# EAGLE schematic 604_romwriter (EAGLE 7.4.0)
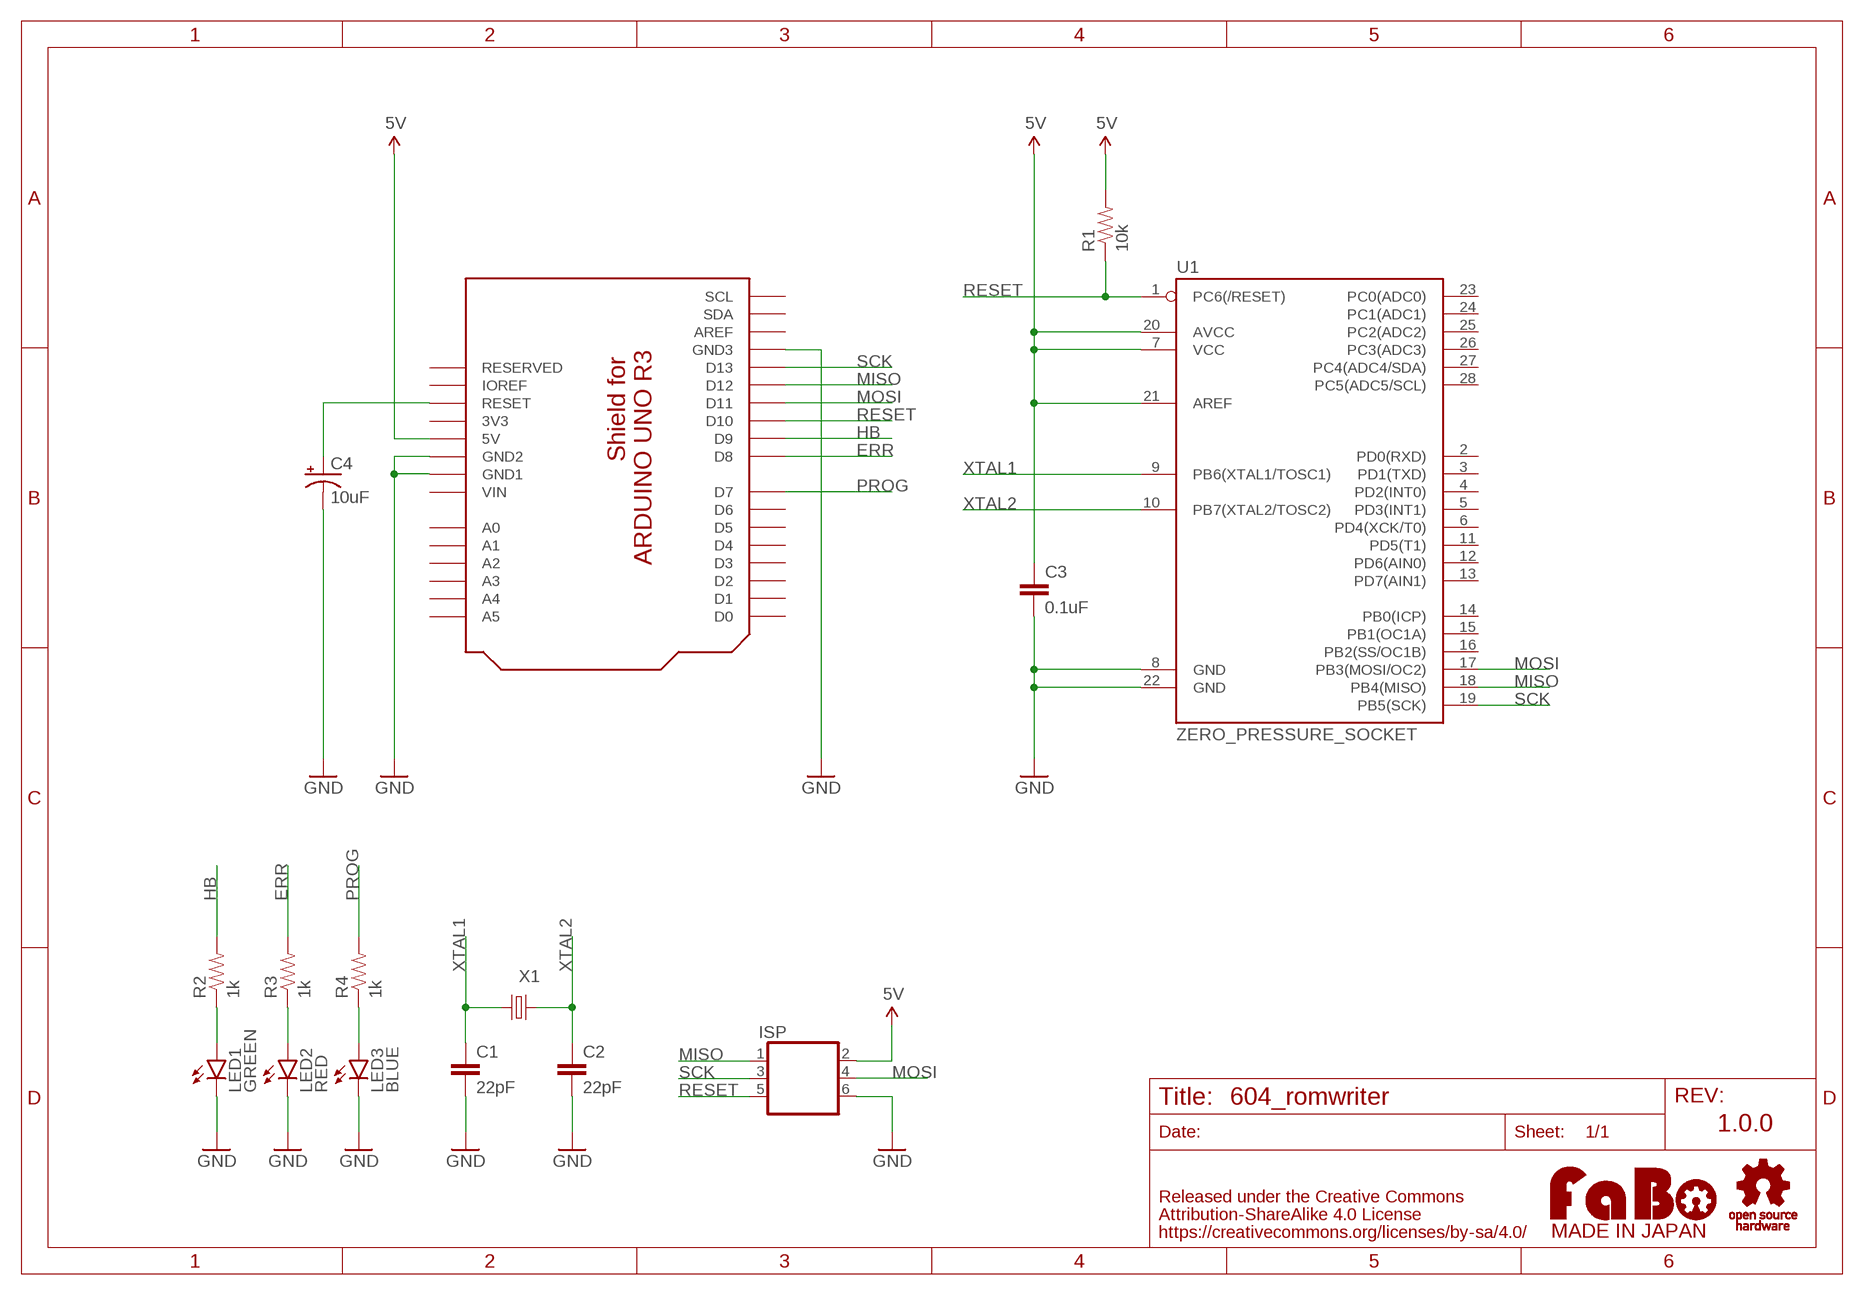
[diagram p0: schematic, sheet 1]

## Parts
C1  22pF  CAP-PTH-SMALL  [CAP-PTH-SMALL]
C2  22pF  CAP-PTH-SMALL  [CAP-PTH-SMALL]
C3  0.1uF  CAP-PTH-SMALL  [CAP-PTH-SMALL]
C4  10uF  CAP_POL-AXL-5MM  [CAP-POL-AXL-5MM]
ISP  PINHEAD_2X3  [PIN_2X3]
LED1  GREEN  LED-5MM  [LED-5MM]
LED2  RED  LED-5MM  [LED-5MM]
LED3  BLUE  LED-5MM  [LED-5MM]
R1  10k  RES-PTH-REGULAR  [RES-AXL-REGULAR]
R2  1k  RES-PTH-REGULAR  [RES-AXL-REGULAR]
R3  1k  RES-PTH-REGULAR  [RES-AXL-REGULAR]
R4  1k  RES-PTH-REGULAR  [RES-AXL-REGULAR]
U1  ZERO_PRESSURE_SOCKET  ATMEGA328P-PUZERO_PRESSURE_SOCKET  [ZERO_PRESSURE_SOCKET_DIL28]
U2  ARDUINO_UNO_R3_SHIELD-NOLABEL  [ARDUINO_UNO_R3_NOLABEL]
U$2  LOGO_OSHW-T_M  [LOGO_OSHW_T_MS]
U$3  LOGO_FABO-M  [LOGO_FABO_MS]
X1  CRYSTAL  [RESONATOR_PTH]

## Nets
5V: C3.1 ISP.2 R1.P$2 U1.7(VCC) U1.20(AVCC) U1.21(AREF) U2.5V
ERR: R3.P$2 U2.D8
GND: C1.2 C2.2 C3.2 C4.- ISP.6 LED1.K(C) LED2.K(C) LED3.K(C) U1.8(GND) U1.22(GND) U2.GND1 U2.GND2 U2.GND3
HB: R2.P$2 U2.D9
MISO: ISP.1 U1.18(PB4(MISO)) U2.D12
MOSI: ISP.4 U1.17(PB3(MOSI/OC2)) U2.D11
N$1: C4.+ U2.RESET
N$6: LED1.A R2.P$1
N$8: LED2.A R3.P$1
N$10: LED3.A R4.P$1
PROG: R4.P$2 U2.D7
RESET: ISP.5 R1.P$1 U1.1(PC6(/RESET)) U2.D10
SCK: ISP.3 U1.19(PB5(SCK)) U2.D13
XTAL1: C1.1 U1.9(PB6(XTAL1/TOSC1)) X1.1
XTAL2: C2.1 U1.10(PB7(XTAL2/TOSC2)) X1.2
Unconnected: U1.2(PD0(RXD)) U1.3(PD1(TXD)) U1.4(PD2(INT0)) U1.5(PD3(INT1)) U1.6(PD4(XCK/T0)) U1.11(PD5(T1)) U1.12(PD6(AIN0)) U1.13(PD7(AIN1)) U1.14(PB0(ICP)) U1.15(PB1(OC1A)) U1.16(PB2(SS/OC1B)) U1.23(PC0(ADC0)) U1.24(PC1(ADC1)) U1.25(PC2(ADC2)) U1.26(PC3(ADC3)) U1.27(PC4(ADC4/SDA)) U1.28(PC5(ADC5/SCL)) U2.A0 U2.A1 U2.A2 U2.A3 U2.A4 U2.A5 U2.AREF U2.D0 U2.D1 U2.D2 U2.D3 U2.D4 U2.D5 U2.D6 U2.IOREF U2.RESERVED U2.SCL U2.SDA

## Notes on the sheet
- 1.0.0

## Power pins joined to a net without a drawn wire
3V3: U2.3V3
VIN: U2.VIN

## Library data of the parts
C1-C3 = FaBo-etc:CAP: Capacitor Standard 0603 ceramic capacitor
C4 = FaBo-etc:CAP_POL: Capacitor Polarized standard SMD and PTH capacitor
ISP = FaBo-etc:PINHEAD_2X3
LED1-LED3 = FaBo-etc:LED: LED
R1-R4 = FaBo-etc:RES
U1 = FaBo-etc:ATMEGA328P-PU
U2 = FaBo-Boards:ARDUINO_UNO_R3_SHIELD
U$2 = FaBo-etc:LOGO_OSHW
U$3 = FaBo-etc:LOGO_FABO
X1 = FaBo-etc:CRYSTAL

## Net classes
0 default: width 0.305 mm